# Altium schematic sheet [14] - ETHERNET 10_100_1000.SchDoc
size A3; DocumentNumber: 14; SheetNumber: 14; SheetTotal: 15
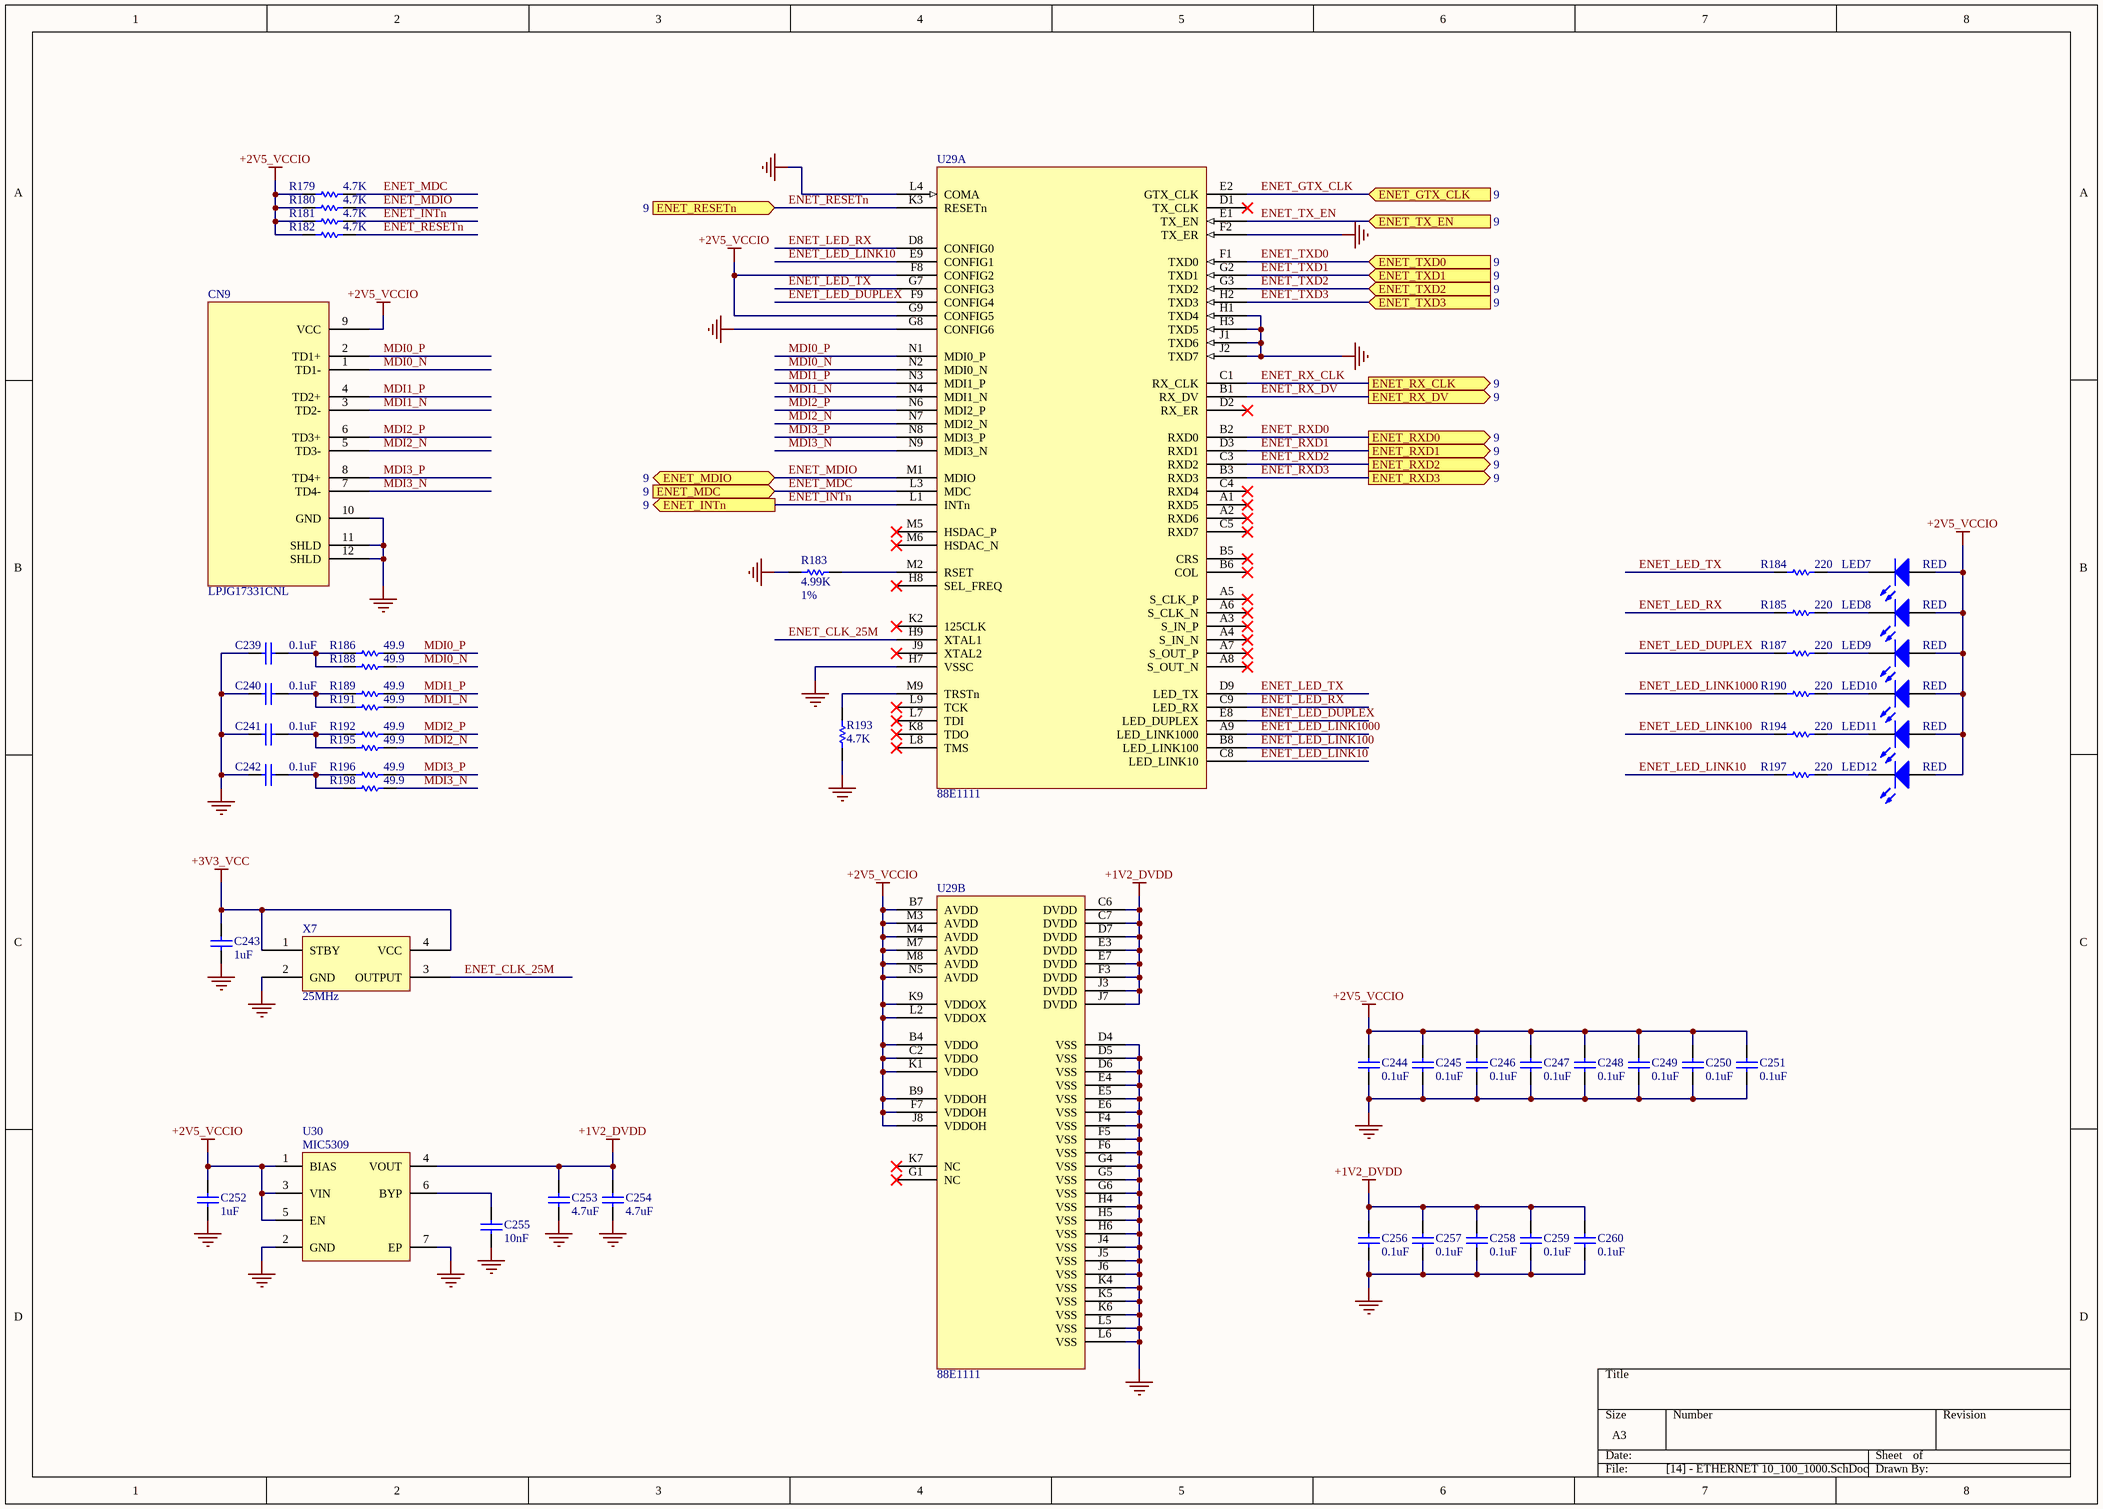
[diagram p0: [14] - ETHERNET 10_100_1000.SchDoc]

## Parts
C239  0.1uF  [0402_C]
C240  0.1uF  [0402_C]
C241  0.1uF  [0402_C]
C242  0.1uF  [0402_C]
C243  1uF  [0402_C]
C244  0.1uF  [0402_C]
C245  0.1uF  [0402_C]
C246  0.1uF  [0402_C]
C247  0.1uF  [0402_C]
C248  0.1uF  [0402_C]
C249  0.1uF  [0402_C]
C250  0.1uF  [0402_C]
C251  0.1uF  [0402_C]
C252  1uF  [0805_C]
C253  4.7uF  [0805_C]
C254  4.7uF  [0805_C]
C255  10nF  [0805_C]
C256  0.1uF  [0402_C]
C257  0.1uF  [0402_C]
C258  0.1uF  [0402_C]
C259  0.1uF  [0402_C]
C260  0.1uF  [0402_C]
CN9  LPJG17331CNL  [LPJG17331CNL]
LED7  RED  [LED_0603]
LED8  RED  [LED_0603]
LED9  RED  [LED_0603]
LED10  RED  [LED_0603]
LED11  RED  [LED_0603]
LED12  RED  [LED_0603]
R179  4.7K  [0402_R]
R180  4.7K  [0402_R]
R181  4.7K  [0402_R]
R182  4.7K  [0402_R]
R183  4.99K  Tolerance: 1%  [0402_R]
R184  220  [0805_R]
R185  220  [0805_R]
R186  49.9  [0402_R]
R187  220  [0805_R]
R188  49.9  [0402_R]
R189  49.9  [0402_R]
R190  220  [0805_R]
R191  49.9  [0402_R]
R192  49.9  [0402_R]
R193  4.7K  [0402_R]
R194  220  [0805_R]
R195  49.9  [0402_R]
R196  49.9  [0402_R]
R197  220  [0805_R]
R198  49.9  [0402_R]
U29  88E1111  (parts A,B of 2)
U30  MIC5309  [DFN-6]
X7  25MHz  [OSC_3.2x2.5]

## Ports
ENET_GTX_CLK (in, see 9), ENET_INTn (out, see 9), ENET_MDC (in, see 9), ENET_MDIO (bidir, see 9), ENET_RESETn (in, see 9), ENET_RX_CLK (out, see 9), ENET_RX_DV (out, see 9), ENET_RXD0 (out, see 9), ENET_RXD1 (out, see 9), ENET_RXD2 (out, see 9), ENET_RXD3 (out, see 9), ENET_TX_EN (in, see 9), ENET_TXD0 (in, see 9), ENET_TXD1 (in, see 9), ENET_TXD2 (in, see 9), ENET_TXD3 (in, see 9)

## Nets
+1V2_DVDD: C253.2 C254.2 C256.1 C257.1 C258.1 C259.1 C260.1 U29.C6(DVDD) U29.C7(DVDD) U29.D7(DVDD) U29.E3(DVDD) U29.E7(DVDD) U29.F3(DVDD) U29.J3(DVDD) U29.J7(DVDD) U30.4(VOUT)
+2V5_VCCIO: C244.1 C245.1 C246.1 C247.1 C248.1 C249.1 C250.1 C251.1 C252.2 CN9.9(VCC) LED7.1(A) LED8.1(A) LED9.1(A) LED10.1(A) LED11.1(A) LED12.1(A) R179.2 R180.2 R181.2 R182.2 U29.B4(VDDO) U29.B7(AVDD) U29.B9(VDDOH) U29.C2(VDDO) U29.F7(VDDOH) U29.F8(CONFIG2) U29.G9(CONFIG5) U29.J8(VDDOH) U29.K1(VDDO) U29.K9(VDDOX) U29.L2(VDDOX) U29.M3(AVDD) U29.M4(AVDD) U29.M7(AVDD) U29.M8(AVDD) U29.N5(AVDD) U30.1(BIAS) U30.3(VIN) U30.5(EN)
+3V3_VCC: C243.2 X7.1(STBY) X7.4(VCC)
GND: C239.1 C240.1 C241.1 C242.1 C243.1 C244.2 C245.2 C246.2 C247.2 C248.2 C249.2 C250.2 C251.2 C252.1 C253.1 C254.1 C255.1 C256.2 C257.2 C258.2 C259.2 C260.2 CN9.10(GND) CN9.11(SHLD) CN9.12(SHLD) R183.2 R193.1 U29.D4(VSS) U29.D5(VSS) U29.D6(VSS) U29.E4(VSS) U29.E5(VSS) U29.E6(VSS) U29.F2(TX_ER) U29.F4(VSS) U29.F5(VSS) U29.F6(VSS) U29.G4(VSS) U29.G5(VSS) U29.G6(VSS) U29.G8(CONFIG6) U29.H1(TXD4) U29.H3(TXD5) U29.H4(VSS) U29.H5(VSS) U29.H6(VSS) U29.H7(VSSC) U29.J1(TXD6) U29.J2(TXD7) U29.J4(VSS) U29.J5(VSS) U29.J6(VSS) U29.K4(VSS) U29.K5(VSS) U29.K6(VSS) U29.L4(COMA) U29.L5(VSS) U29.L6(VSS) U30.2(GND) U30.7(EP) X7.2(GND)
ENET_CLK_25M: U29.H9(XTAL1) X7.3(OUTPUT)
ENET_GTX_CLK: U29.E2(GTX_CLK) ; port ENET_GTX_CLK
ENET_INTn: R181.1 U29.L1(INTn) ; port ENET_INTn
ENET_LED_DUPLEX: R187.1 U29.E8(LED_DUPLEX) U29.F9(CONFIG4)
ENET_LED_LINK10: R197.1 U29.C8(LED_LINK10) U29.E9(CONFIG1)
ENET_LED_LINK100: R194.1 U29.B8(LED_LINK100)
ENET_LED_LINK1000: R190.1 U29.A9(LED_LINK1000)
ENET_LED_RX: R185.1 U29.C9(LED_RX) U29.D8(CONFIG0)
ENET_LED_TX: R184.1 U29.D9(LED_TX) U29.G7(CONFIG3)
ENET_MDC: R179.1 U29.L3(MDC) ; port ENET_MDC
ENET_MDIO: R180.1 U29.M1(MDIO) ; port ENET_MDIO
ENET_RESETn: R182.1 U29.K3(RESETn) ; port ENET_RESETn
ENET_RX_CLK: U29.C1(RX_CLK) ; port ENET_RX_CLK
ENET_RX_DV: U29.B1(RX_DV) ; port ENET_RX_DV
ENET_RXD0: U29.B2(RXD0) ; port ENET_RXD0
ENET_RXD1: U29.D3(RXD1) ; port ENET_RXD1
ENET_RXD2: U29.C3(RXD2) ; port ENET_RXD2
ENET_RXD3: U29.B3(RXD3) ; port ENET_RXD3
ENET_TX_EN: U29.E1(TX_EN) ; port ENET_TX_EN
ENET_TXD0: U29.F1(TXD0) ; port ENET_TXD0
ENET_TXD1: U29.G2(TXD1) ; port ENET_TXD1
ENET_TXD2: U29.G3(TXD2) ; port ENET_TXD2
ENET_TXD3: U29.H2(TXD3) ; port ENET_TXD3
MDI0_N: CN9.1(TD1-) R188.1 U29.N2(MDI0_N)
MDI0_P: CN9.2(TD1+) R186.1 U29.N1(MDI0_P)
MDI1_N: CN9.3(TD2-) R191.1 U29.N4(MDI1_N)
MDI1_P: CN9.4(TD2+) R189.1 U29.N3(MDI1_P)
MDI2_N: CN9.5(TD3-) R195.1 U29.N7(MDI2_N)
MDI2_P: CN9.6(TD3+) R192.1 U29.N6(MDI2_P)
MDI3_N: CN9.7(TD4-) R198.1 U29.N9(MDI3_N)
MDI3_P: CN9.8(TD4+) R196.1 U29.N8(MDI3_P)
NetC239_2: C239.2 R186.2 R188.2
NetC240_2: C240.2 R189.2 R191.2
NetC241_2: C241.2 R192.2 R195.2
NetC242_2: C242.2 R196.2 R198.2
NetC255_2: C255.2 U30.6(BYP)
NetLED7_2: LED7.2(K) R184.2
NetLED8_2: LED8.2(K) R185.2
NetLED9_2: LED9.2(K) R187.2
NetLED10_2: LED10.2(K) R190.2
NetLED11_2: LED11.2(K) R194.2
NetLED12_2: LED12.2(K) R197.2
NetR183_1: R183.1 U29.M2(RSET)
NetR193_2: R193.2 U29.M9(TRSTn)

Not connected (* = marked no-connect by the designer): U29 A1(RXD5)* A2(RXD6)* A3(S_IN_P)* A4(S_IN_N)* A5(S_CLK_P)* A6(S_CLK_N)* A7(S_OUT_P)* A8(S_OUT_N)* B5(CRS)* B6(COL)* C4(RXD4)* C5(RXD7)* D1(TX_CLK)* D2(RX_ER)* G1(NC)* H8(SEL_FREQ)* J9(XTAL2)* K2(125CLK)* K7(NC)* K8(TDO)* L7(TDI)* L8(TMS)* L9(TCK)* M5(HSDAC_P)* M6(HSDAC_N)*

## Library data of the parts
C239-C251 C256-C260 = Cap SMD: Non-Pol SMD Capacitor; RATED_VOLTAGE: 16V; Manufacturer Part Num: *; Dielectric: *
  C239-C242 C244-C251 C256-C260: Value: 0.1uF
  C243: Value: 1uF
C252-C255 = Cap SMD: Non-Pol SMD Capacitor; RATED_VOLTAGE: 25V; Manufacturer Part Num: *; Dielectric: *
  C252: Value: 1uF
  C253 C254: Value: 4.7uF
  C255: Value: 10nF
CN9 = LPJG17331CNL: 100/1000 Base-T Modular jack RJ45 With Transformer Tab Up Without Led; Value: LPJG17331CNL; Manufacturer Part Num: LPJG17331CNL
LED7-LED12 = LED: Typical LED; Value: RED
R179-R182 R184-R198 = Res SMD: SMD Resistor; Tolerance: 5%; Manufacturer Part Num: *
  R179-R182 R193: Value: 4.7K
  R184 R185 R187 R190 R194 R197: Value: 220
  R186 R188 R189 R191 R192 R195 R196 R198: Value: 49.9
R183 = Res SMD: SMD Resistor; Value: 4.99K; Manufacturer Part Num: *
U29 = 88E1111: Integrated 10/100/1000 Ultra Gigabit Ethernet Transceiver; Value: 88E1111; Manufacturer Part Num: *
U30 = MIC5309: Low Vin/Vout 300mA High PSRR ULDO with Ultra-Low IQ; Manufacturer Part Num: MIC5309-1.2YMT; Value: MIC5309
X7 = XTAL OSC: Crystal Oscillator; Value: 25MHz